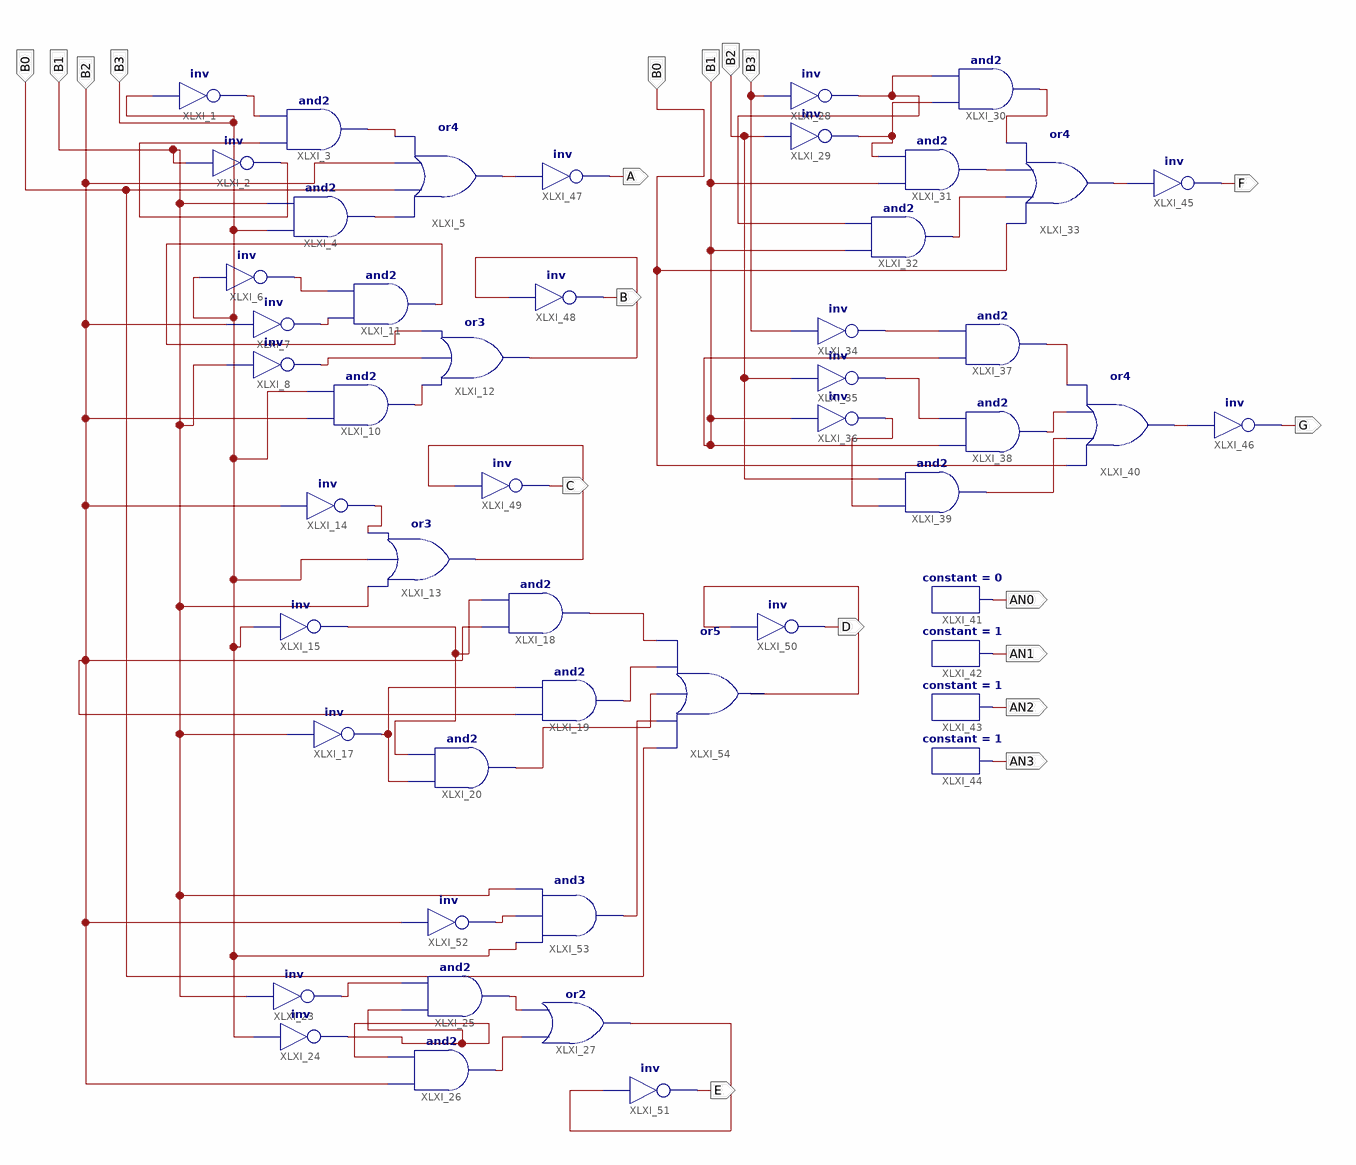
[diagram p0: schematic sheet 1]
// Xilinx ISE schematic SEVEN.sch (spartan6) as structural Verilog: 50 symbols, 15 ports
module SEVEN (
  input  B3,
  input  B1,
  input  B0,
  input  B2,
  output AN0,
  output AN1,
  output AN2,
  output AN3,
  output A,
  output B,
  output C,
  output D,
  output E,
  output G,
  output F
);

  wire XLXN_1, XLXN_2, XLXN_9, XLXN_10, XLXN_19, XLXN_20, XLXN_23, XLXN_24, XLXN_25, XLXN_27, XLXN_35,
       XLXN_43, XLXN_44, XLXN_50, XLXN_51, XLXN_54, XLXN_55, XLXN_106, XLXN_107, XLXN_110, XLXN_111,
       XLXN_112, XLXN_119, XLXN_122, XLXN_123, XLXN_124, XLXN_125, XLXN_126, XLXN_190, XLXN_191, XLXN_192,
       XLXN_193, XLXN_194, XLXN_195, XLXN_196, XLXN_216, XLXN_218, XLXN_221, XLXN_222;

  not XLXI_1 (XLXN_1, B3);
  not XLXI_2 (XLXN_2, B1);
  and XLXI_3 (XLXN_9, XLXN_2, XLXN_1);
  and XLXI_4 (XLXN_10, B3, B1);
  or XLXI_5 (XLXN_192, XLXN_10, B0, B2, XLXN_9);
  not XLXI_6 (XLXN_19, B3);
  not XLXI_7 (XLXN_20, B2);
  not XLXI_8 (XLXN_24, B1);
  and XLXI_10 (XLXN_25, B2, B3);
  and XLXI_11 (XLXN_23, XLXN_20, XLXN_19);
  or XLXI_12 (XLXN_196, XLXN_25, XLXN_24, XLXN_23);
  or XLXI_13 (XLXN_195, B1, B3, XLXN_27);
  not XLXI_14 (XLXN_27, B2);
  not XLXI_15 (XLXN_35, B3);
  not XLXI_17 (XLXN_218, B1);
  and XLXI_18 (XLXN_43, B2, XLXN_35);
  and XLXI_19 (XLXN_44, B2, XLXN_218);
  and XLXI_20 (XLXN_221, XLXN_218, XLXN_35);
  not XLXI_23 (XLXN_50, B1);
  not XLXI_24 (XLXN_51, B3);
  and XLXI_25 (XLXN_54, XLXN_51, XLXN_50);
  and XLXI_26 (XLXN_55, B2, XLXN_51);
  or XLXI_27 (XLXN_193, XLXN_55, XLXN_54);
  not XLXI_28 (XLXN_106, B3);
  not XLXI_29 (XLXN_107, B2);
  and XLXI_30 (XLXN_110, XLXN_107, XLXN_106);
  and XLXI_31 (XLXN_111, B1, XLXN_107);
  and XLXI_32 (XLXN_112, B1, XLXN_106);
  or XLXI_33 (XLXN_190, B0, XLXN_112, XLXN_111, XLXN_110);
  not XLXI_34 (XLXN_123, B3);
  not XLXI_35 (XLXN_122, B2);
  not XLXI_36 (XLXN_119, B1);
  and XLXI_37 (XLXN_124, B1, XLXN_123);
  and XLXI_38 (XLXN_125, B1, XLXN_122);
  and XLXI_39 (XLXN_126, XLXN_119, B2);
  or XLXI_40 (XLXN_191, B0, XLXN_126, XLXN_125, XLXN_124);
  constant #(.CValue("0")) XLXI_41 (.O(AN0));
  constant #(.CValue("1")) XLXI_42 (.O(AN1));
  constant #(.CValue("1")) XLXI_43 (.O(AN2));
  constant #(.CValue("1")) XLXI_44 (.O(AN3));
  not XLXI_45 (F, XLXN_190);
  not XLXI_46 (G, XLXN_191);
  not XLXI_47 (A, XLXN_192);
  not XLXI_48 (B, XLXN_196);
  not XLXI_49 (C, XLXN_195);
  not XLXI_50 (D, XLXN_194);
  not XLXI_51 (E, XLXN_193);
  not XLXI_52 (XLXN_216, B2);
  and XLXI_53 (XLXN_222, B3, XLXN_216, B1);
  or XLXI_54 (XLXN_194, B0, XLXN_222, XLXN_221, XLXN_44, XLXN_43);
endmodule
